# Altium schematic sheet 01 REVISION HISTORY.SchDoc
size 420 x 297 mm
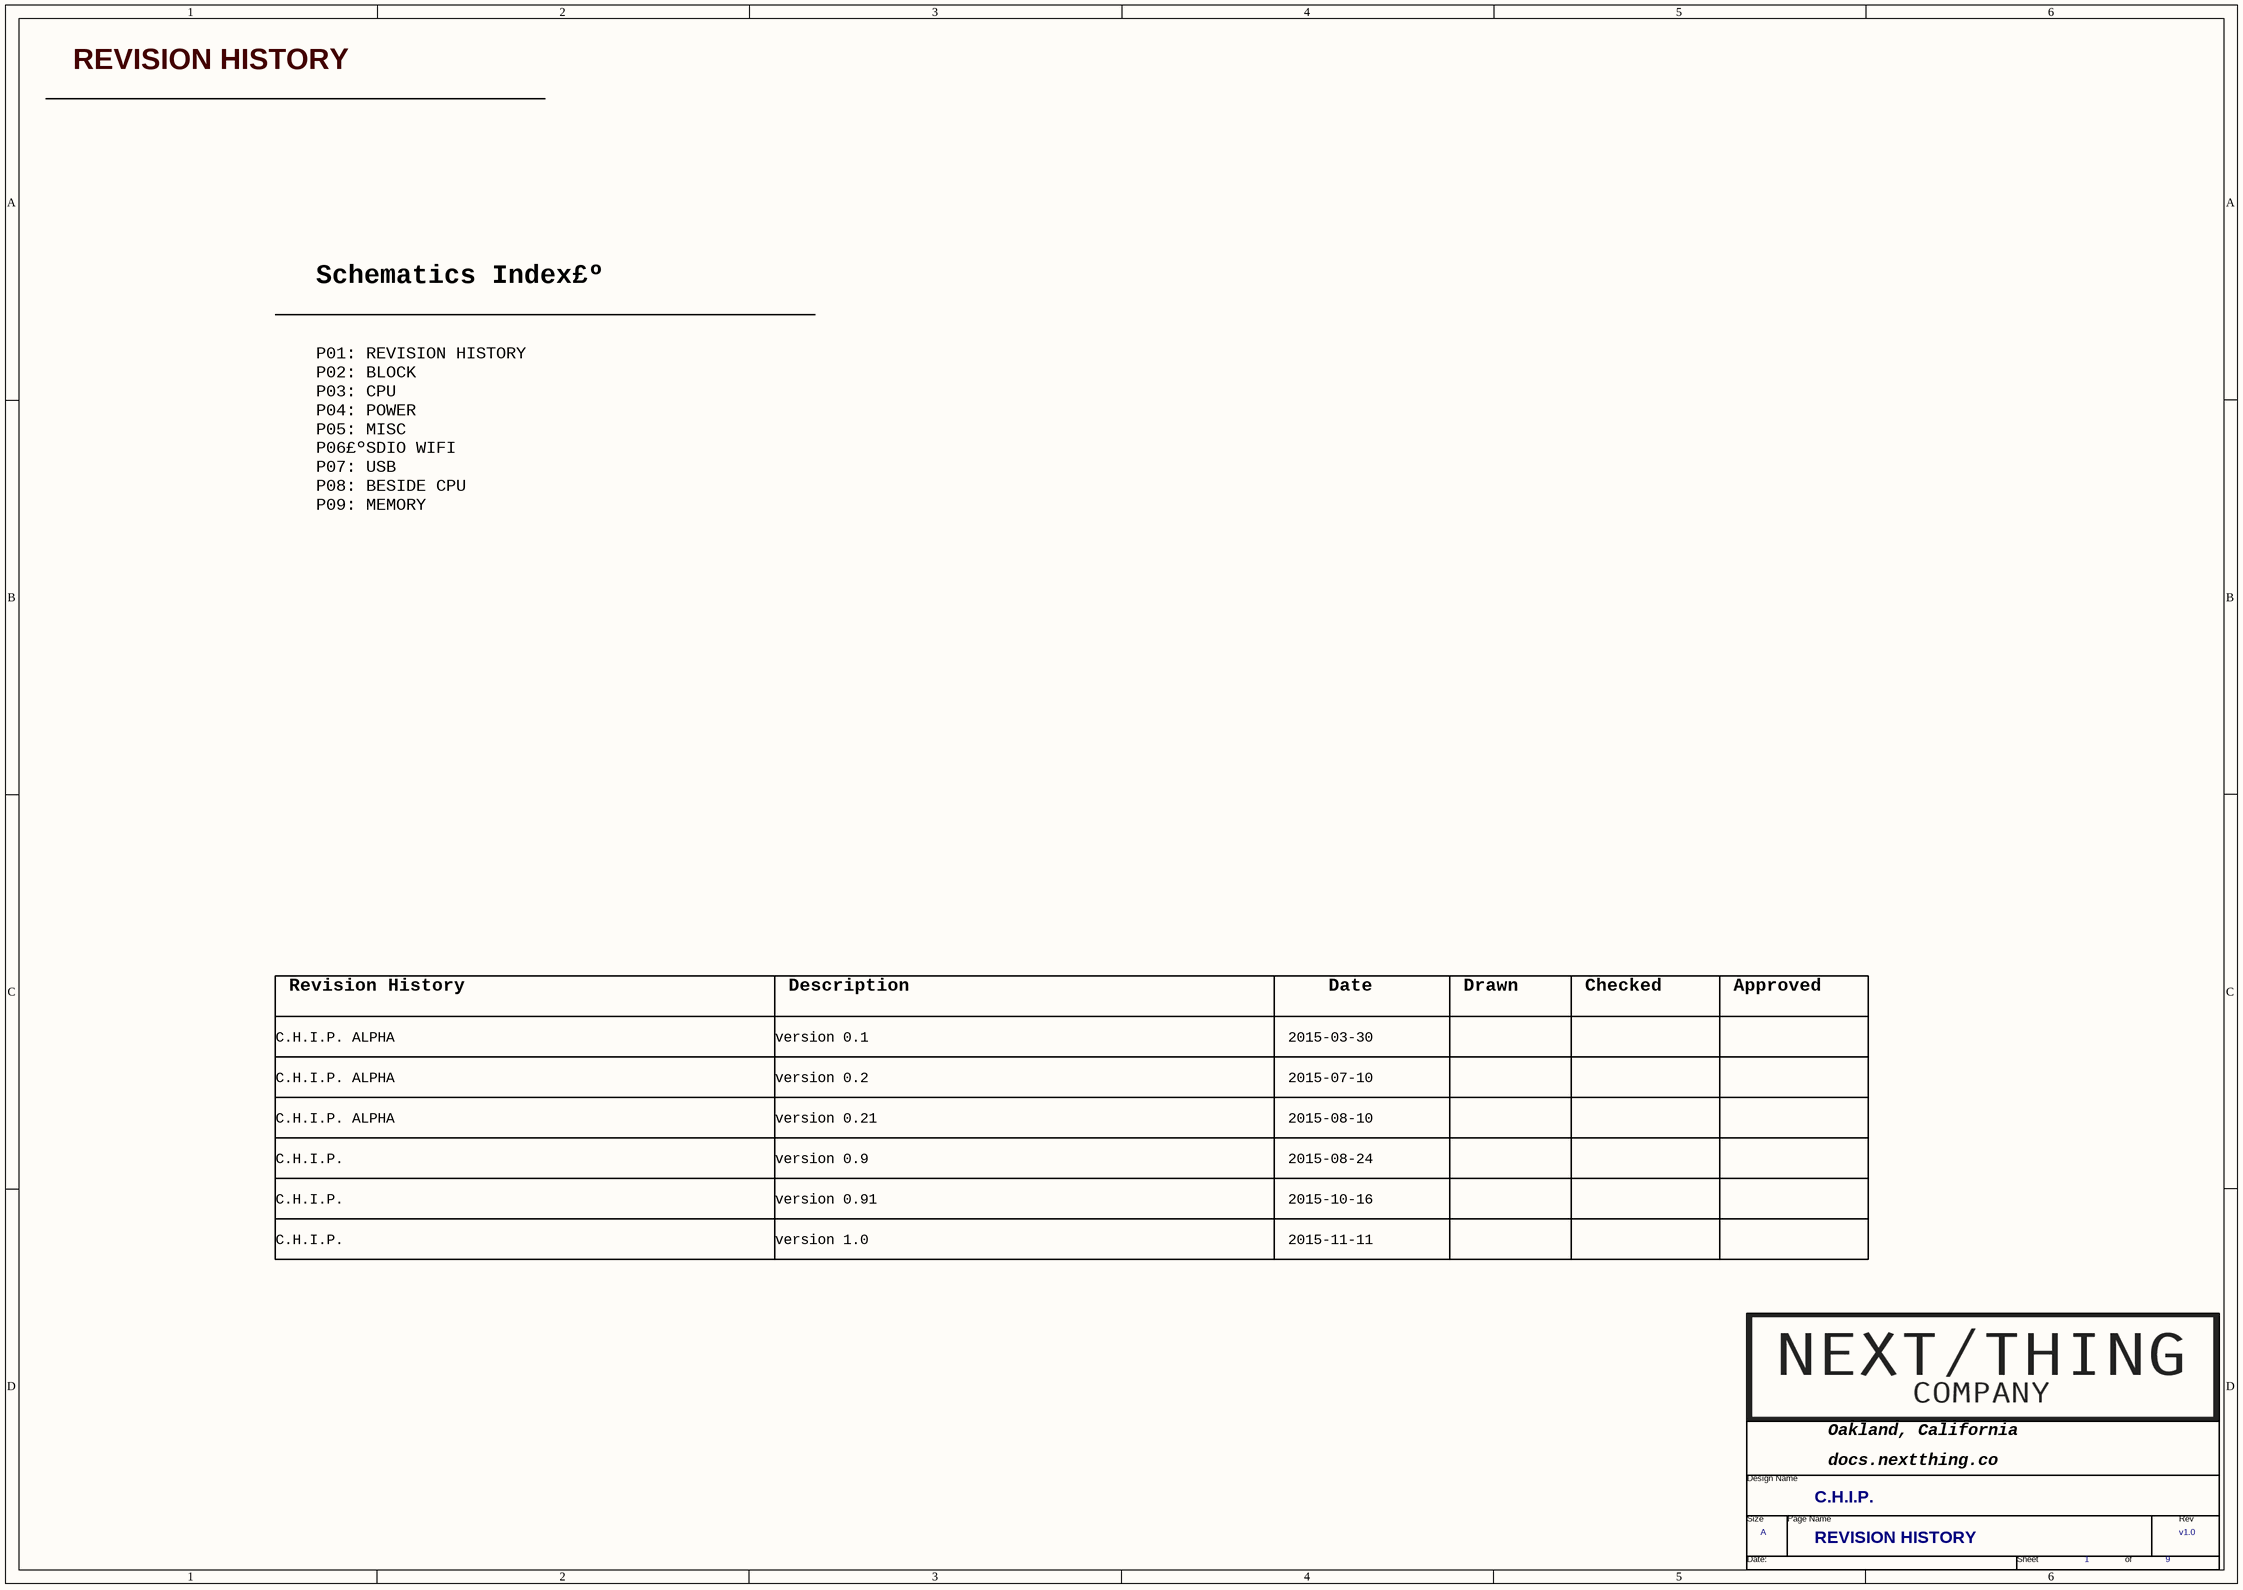
[diagram p0: 01 REVISION HISTORY.SchDoc]

## Parts
*  Page Count: 9  Page Number: 1  Page Size: A  Title: C.H.I.P.  RevCode: v1.0  Doc: REVISION HISTORY  (hidden comment: TitleBlock1-nextthing)  (graphical)

## Notes on the sheet
- REVISION HISTORY
- Schematics Index£º
- P01: REVISION HISTORY
  P02: BLOCK
  P03: CPU
  P04: POWER
  P05: MISC
  P06£ºSDIO WIFI
  P07: USB
  P08: BESIDE CPU
  P09: MEMORY
- Revision History
- Description
- Date
- Drawn
- Checked
- Approved
- C.H.I.P. ALPHA
- version 0.1
- 2015-03-30
- version 0.2
- version 0.21
- 2015-07-10
- 2015-08-10
- C.H.I.P.
- version 0.9
- version 0.91
- 2015-08-24
- 2015-10-16
- version 1.0
- 2015-11-11
- (in symbol TitleBlock1-nextthing) Oakland, California; Design Name; docs.nextthing.co /; Size; Page Name; Rev; Date:; Sheet; of

## Library data of the parts
* = TitleBlock1-nextthing: Page Create Date: March  8, 1995